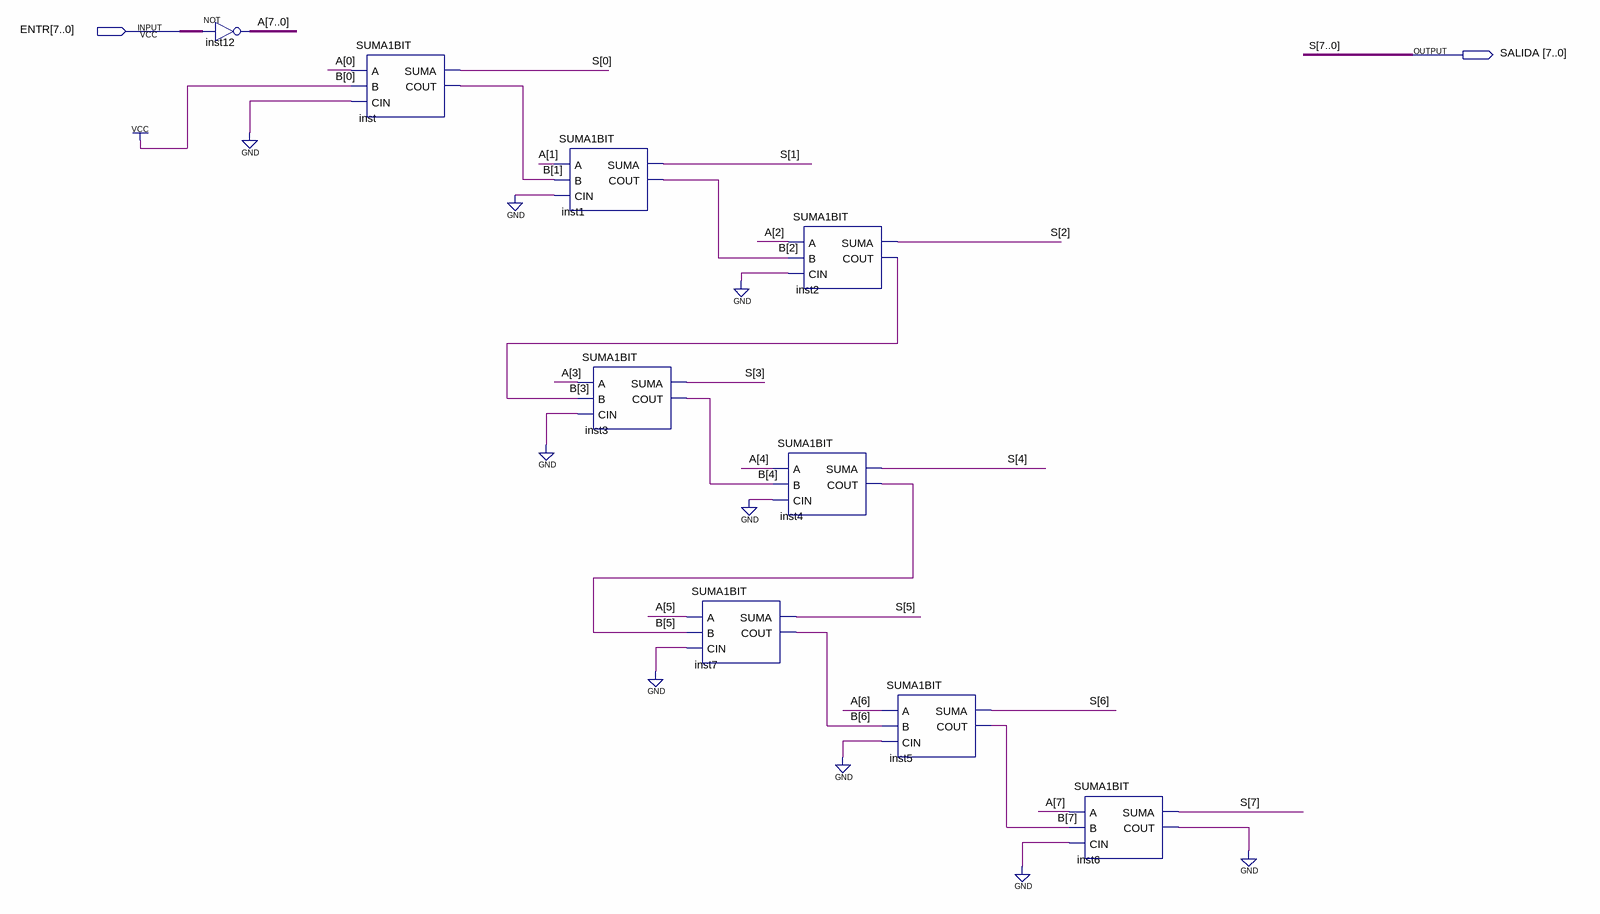
[diagram p0: schematic sheet]
// Quartus schematic COMPLE.bdf as structural Verilog: 9 symbols, 2 pins
module COMPLE (
  input  [7:0] ENTR,
  output [7:0] SALIDA
);

  wire inst6_cout;
  wire [7:0] A;
  wire [7:1] B;

  assign A = ~ENTR;  // NOT inst12, 8 bits wide
  SUMA1BIT inst (.A(A[0]), .B(1'b1), .CIN(1'b0), .SUMA(SALIDA[0]), .COUT(B[1]));
  SUMA1BIT inst1 (.A(A[1]), .B(B[1]), .CIN(1'b0), .SUMA(SALIDA[1]), .COUT(B[2]));
  SUMA1BIT inst3 (.A(A[3]), .B(B[3]), .CIN(1'b0), .SUMA(SALIDA[3]), .COUT(B[4]));
  SUMA1BIT inst7 (.A(A[5]), .B(B[5]), .CIN(1'b0), .SUMA(SALIDA[5]), .COUT(B[6]));
  SUMA1BIT inst2 (.A(A[2]), .B(B[2]), .CIN(1'b0), .SUMA(SALIDA[2]), .COUT(B[3]));
  SUMA1BIT inst4 (.A(A[4]), .B(B[4]), .CIN(1'b0), .SUMA(SALIDA[4]), .COUT(B[5]));
  SUMA1BIT inst5 (.A(A[6]), .B(B[6]), .CIN(1'b0), .SUMA(SALIDA[6]), .COUT(B[7]));
  SUMA1BIT inst6 (.A(A[7]), .B(B[7]), .CIN(1'b0), .SUMA(SALIDA[7]), .COUT(inst6_cout));
  // also tied to GND on the sheet: inst6_cout

  // Other names for the same wires on the sheet: S[7:0] = SALIDA
endmodule
